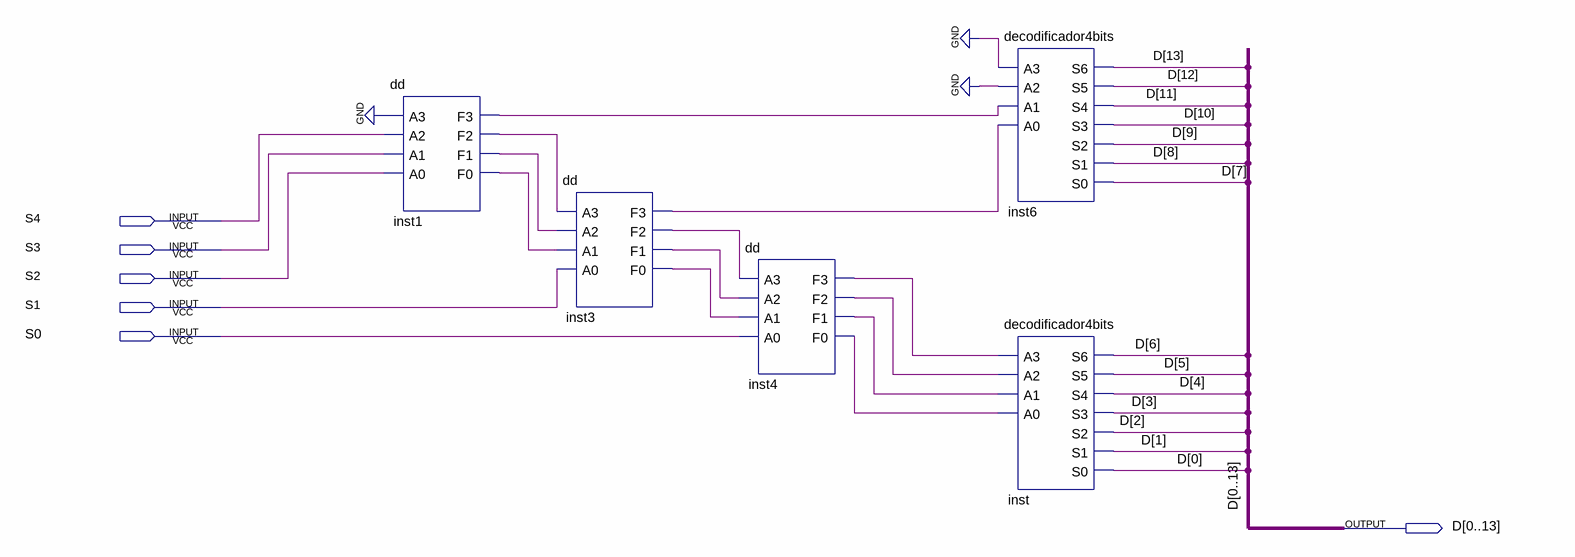
[diagram p0: schematic sheet]
// Quartus schematic decodificar_S.bdf as structural Verilog: 5 symbols, 6 pins
module decodificar_S (
  input  S4,
  input  S3,
  input  S2,
  input  S1,
  input  S0,
  output [0:13] D
);

  wire inst1_f0, inst1_f1, inst1_f2, inst1_f3, inst3_f0, inst3_f1, inst3_f2, inst3_f3, inst4_f0, inst4_f1,
       inst4_f2, inst4_f3;

  dd inst1 (.A3(1'b0), .A2(S4), .A1(S3), .A0(S2), .F3(inst1_f3), .F2(inst1_f2), .F1(inst1_f1), .F0(inst1_f0));
  dd inst3 (
    .A3(inst1_f2), .A2(inst1_f1), .A1(inst1_f0), .A0(S1), .F3(inst3_f3), .F2(inst3_f2), .F1(inst3_f1),
    .F0(inst3_f0));
  dd inst4 (
    .A3(inst3_f2), .A2(inst3_f1), .A1(inst3_f0), .A0(S0), .F3(inst4_f3), .F2(inst4_f2), .F1(inst4_f1),
    .F0(inst4_f0));
  decodificador4bits inst6 (
    .A3(1'b0), .A2(1'b0), .A1(inst1_f3), .A0(inst3_f3), .S6(D[13]), .S5(D[12]), .S4(D[11]), .S3(D[10]),
    .S2(D[9]), .S1(D[8]), .S0(D[7]));
  decodificador4bits inst (
    .A3(inst4_f3), .A2(inst4_f2), .A1(inst4_f1), .A0(inst4_f0), .S6(D[6]), .S5(D[5]), .S4(D[4]), .S3(D[3]),
    .S2(D[2]), .S1(D[1]), .S0(D[0]));
endmodule
